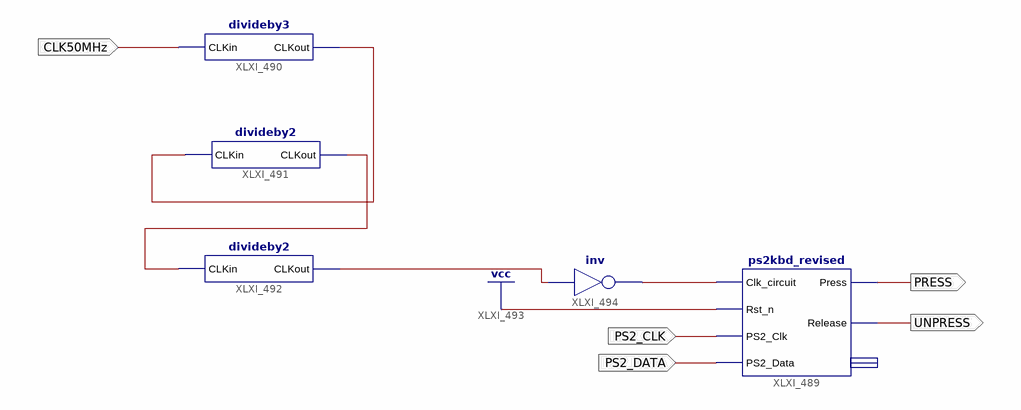
[diagram p0: schematic sheet 1]
// Xilinx ISE schematic ps2_test.sch (spartan3e) as structural Verilog: 5 symbols, 5 ports
module ps2_test (
  input  PS2_CLK,
  input  PS2_DATA,
  input  CLK50MHz,
  output PRESS,
  output UNPRESS
);

  wire XLXN_6, XLXN_7, XLXN_10, XLXN_11;

  ps2kbd_revised XLXI_489 (
    .Rst_n(1'b1), .Clk_circuit(XLXN_10), .PS2_Clk(PS2_CLK), .PS2_Data(PS2_DATA), .Press(PRESS),
    .Release(UNPRESS));  // open: ScanCode
  divideby3 XLXI_490 (.CLKin(CLK50MHz), .CLKout(XLXN_6));
  divideby2 XLXI_491 (.CLKin(XLXN_6), .CLKout(XLXN_7));
  divideby2 XLXI_492 (.CLKin(XLXN_7), .CLKout(XLXN_11));
  not XLXI_494 (XLXN_10, XLXN_11);
endmodule
